# Altium project gen.PrjPcb
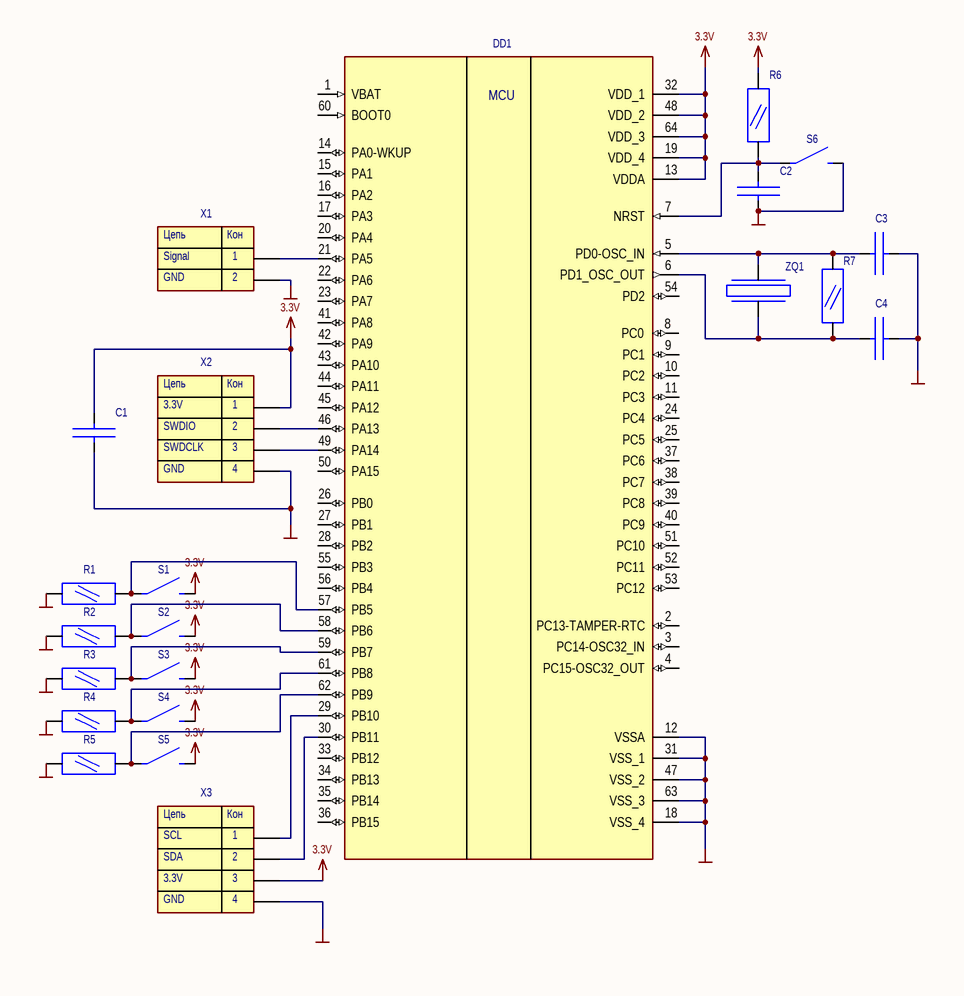
[diagram p0: Sheet1.SchDoc]
1 sheet, 22 parts. Net scope: global (net labels, ports and power ports of the same name join across sheets).

## Sheet Sheet1.SchDoc
size 209 x 297 mm; SheetNumber: 1; SheetTotal: 1; Scale: 1:1; Разраб.: Вебер Д. С.; Обозначение документа: Э3; Наименование изделия 1: Генератор сигналов; Наименование изделия 2: Схема электрическая; Наименование изделия 3: принципиальная; Нач. отд.: Нач. отд.

### Parts
C1  condensator  (value not drawn)
C2  condensator  (value not drawn)
C3  condensator  (value not drawn)
C4  condensator  (value not drawn)
DD1  STM32F103RCT6  (value not drawn)
R1  resistor  [smd1206]  (value not drawn)
R2  resistor  [smd1206]  (value not drawn)
R3  resistor  [smd1206]  (value not drawn)
R4  resistor  [smd1206]  (value not drawn)
R5  resistor  [smd1206]  (value not drawn)
R6  resistor  [smd1206]  (value not drawn)
R7  resistor  [smd1206]  (value not drawn)
S1  knopka  (value not drawn)
S2  knopka  (value not drawn)
S3  knopka  (value not drawn)
S4  knopka  (value not drawn)
S5  knopka  (value not drawn)
S6  knopka  (value not drawn)
X1  dac  (value not drawn)
X2  SWD  (value not drawn)
X3  con_i2c_1  (value not drawn)
ZQ1  resonator  (value not drawn)

### Nets
3.3V: C1.2 DD1.13(VDDA) DD1.19(VDD_4) DD1.32(VDD_1) DD1.48(VDD_2) DD1.64(VDD_3) R6.2 S1.2 S2.2 S3.2 S4.2 S5.2 X2.1 X3.3
GND: C1.1 C2.1 C3.2 C4.2 DD1.12(VSSA) DD1.18(VSS_4) DD1.31(VSS_1) DD1.47(VSS_2) DD1.63(VSS_3) R1.1 R2.1 R3.1 R4.1 R5.1 S6.2 X1.2 X2.4 X3.4
NetC2_2: C2.2 DD1.7(NRST) R6.1 S6.1
NetC3_1: C3.1 DD1.5(PD0-OSC_IN) R7.2 ZQ1.1
NetC4_1: C4.1 DD1.6(PD1_OSC_OUT) R7.1 ZQ1.2
NetDD1_21: DD1.21(PA5) X1.1
NetDD1_29: DD1.29(PB10) X3.1
NetDD1_30: DD1.30(PB11) X3.2
NetDD1_46: DD1.46(PA13) X2.2
NetDD1_49: DD1.49(PA14) X2.3
NetDD1_57: DD1.57(PB5) R1.2 S1.1
NetDD1_58: DD1.58(PB6) R2.2 S2.1
NetDD1_59: DD1.59(PB7) R3.2 S3.1
NetDD1_61: DD1.61(PB8) R4.2 S4.1
NetDD1_62: DD1.62(PB9) R5.2 S5.1

Not connected (* = marked no-connect by the designer): DD1 1(VBAT) 2(PC13-TAMPER-RTC) 3(PC14-OSC32_IN) 4(PC15-OSC32_OUT) 8(PC0) 9(PC1) 10(PC2) 11(PC3) 14(PA0-WKUP) 15(PA1) 16(PA2) 17(PA3) 20(PA4) 22(PA6) 23(PA7) 24(PC4) 25(PC5) 26(PB0) 27(PB1) 28(PB2) 33(PB12) 34(PB13) 35(PB14) 36(PB15) 37(PC6) 38(PC7) 39(PC8) 40(PC9) 41(PA8) 42(PA9) 43(PA10) 44(PA11) 45(PA12) 50(PA15) 51(PC10) 52(PC11) 53(PC12) 54(PD2) 55(PB3) 56(PB4) 60(BOOT0)

### Notes on the sheet
- Перв. примен.
- Справ. №
- Подп. и дата
- Инв. № дубл.
- Взам. инв. №
- Разраб.
- Изм.
- Лист
- № докум.
- Подп.
- Дата
- Лит.
- Масса
- Масштаб
- Пров.
- Т.контр.
- Листов
- Инв. № подл.
- Утв.
- Н.контр.
- Копировал
- Формат А4
- (in symbol con_i2c_1) Цепь; Кон; SCL; SDA; 3.3V; GND
- (in symbol dac) Цепь; Кон; Signal; GND
- (in symbol STM32F103RCT6) MCU
- (in symbol SWD) Цепь; Кон; 3.3V; SWDIO; SWDCLK; GND